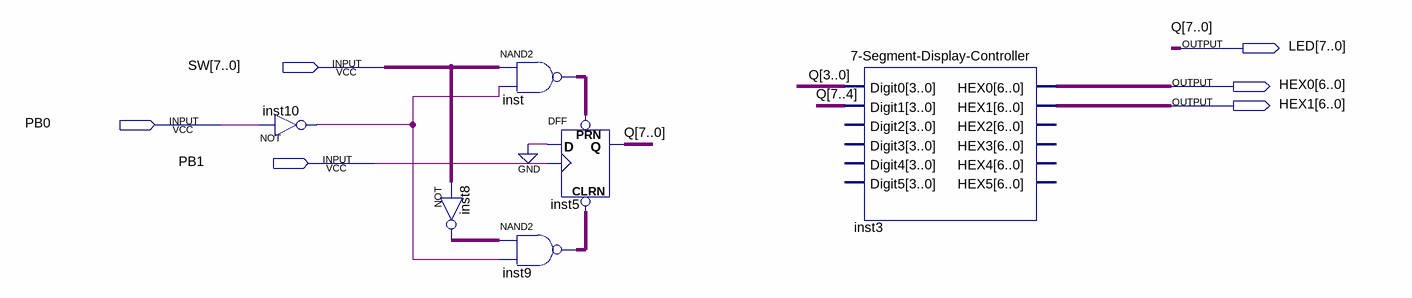
[diagram p0: schematic sheet]
// Quartus schematic TESTE.bdf as structural Verilog: 6 symbols, 6 pins
module TESTE (
  input  [7:0] SW,
  input  PB0,
  input  PB1,
  output [7:0] LED,
  output [6:0] HEX0,
  output [6:0] HEX1
);

  wire inst10_out;
  wire [7:0] inst8_out, inst9_out, inst_out;

  not inst10 (inst10_out, PB0);
  assign inst8_out = ~SW;  // NOT inst8, 8 bits wide
  assign inst_out = ~(SW & {8{inst10_out}});  // NAND2 inst, 8 bits wide
  assign inst9_out = ~(inst8_out & {8{inst10_out}});  // NAND2 inst9, 8 bits wide
  DFF inst5[7:0] (.CLRN(inst9_out), .CLK(PB1), .D(1'b0), .PRN(inst_out), .Q(LED));
  \7-Segment-Display-Controller  inst3 (
    .Digit0(LED[3:0]), .Digit1(LED[7:4]), .HEX0(HEX0), .HEX1(HEX1));  // open: Digit2, Digit3, Digit4, Digit5, HEX2, HEX3, HEX4, HEX5

  // Other names for the same wires on the sheet: Q[7:0] = LED
endmodule
